# EasyEDA Pro project CameraTargetV3.eprj, board PCB1
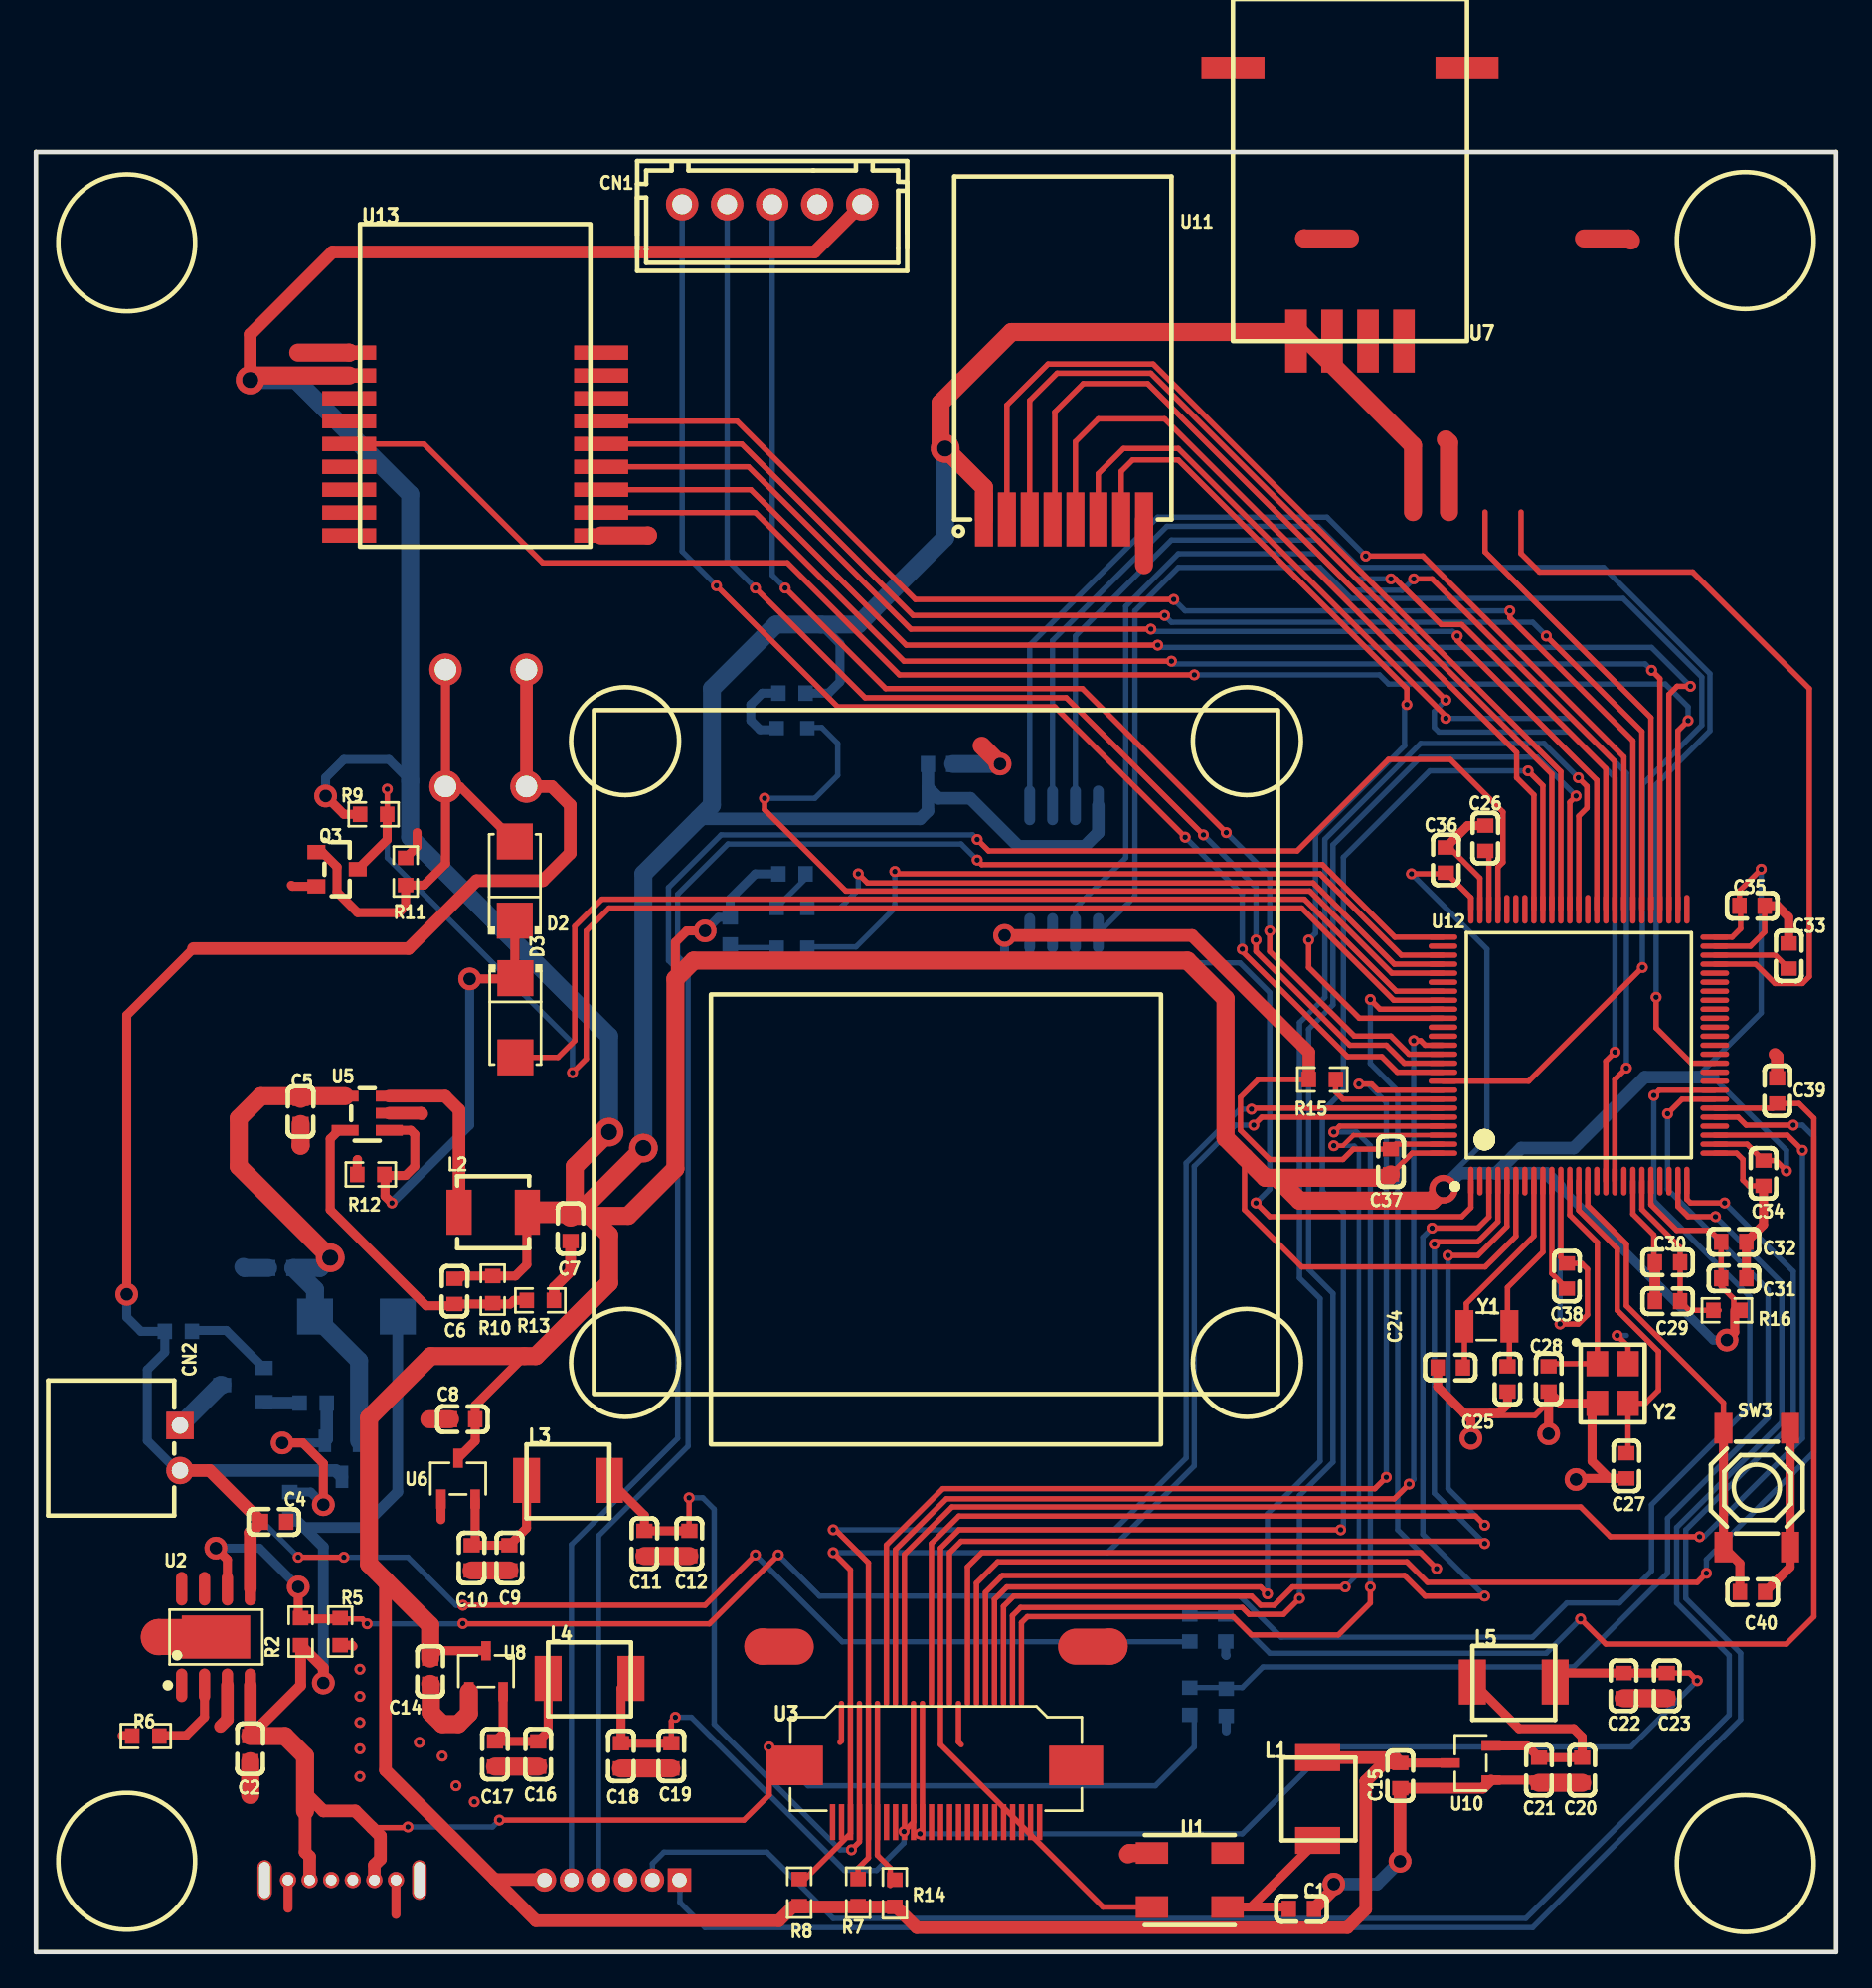
[diagram p1: board, top side]
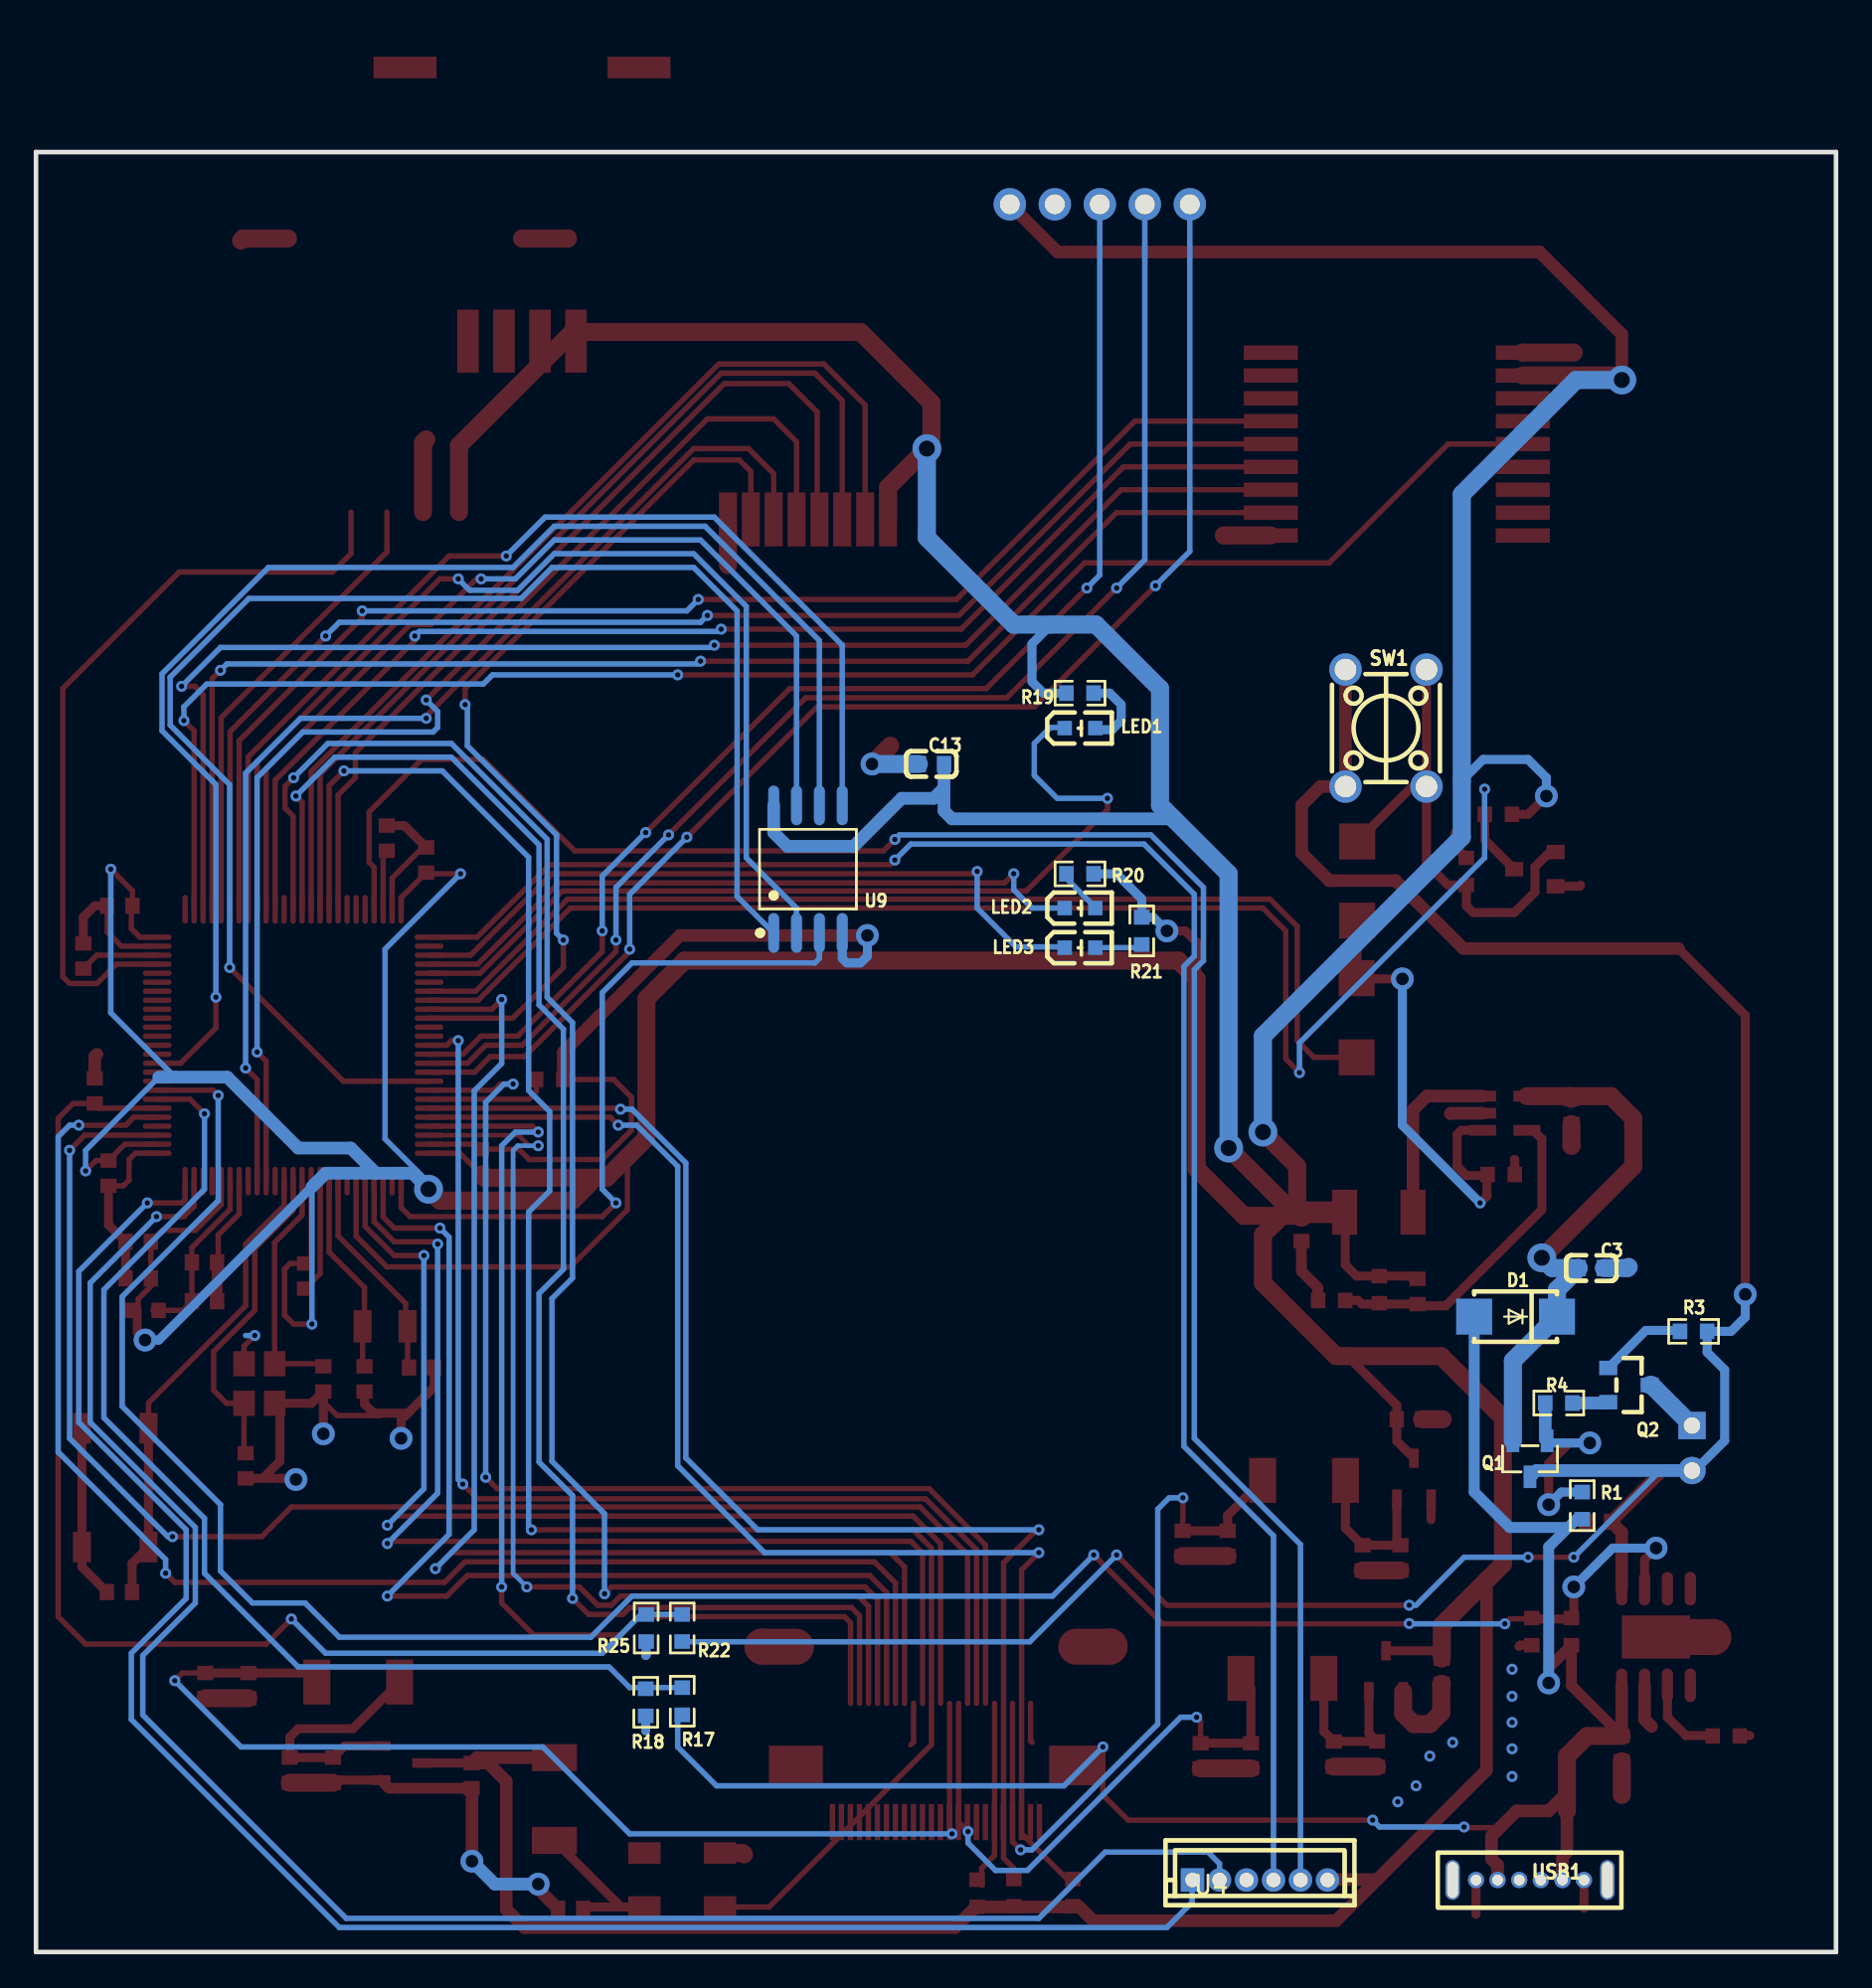
[diagram p2: board, bottom side, seen from below]

Outline 100 x 100 mm; copper layers: Top Layer, Bottom Layer. Coordinates in mm from the lower left corner of the outline.
Outline path: 0,100 0,0 arc(0,0) 0,0 100,0 arc(100,0) 100,0 100,100 arc(100,100) 100,100 0,100 arc(0,100) 0,100
Stack: Top Layer 0.035mm / Dielectric1 1.51mm FR4 er 4.5 / Bottom Layer 0.035mm

## Design rules (mm)
spacing safeClearance (default): track to track 0.152, other pairs 0.152 to 0.3
track width trackWidth (default): min 0.127, default 0.254, max 2.54
differential pair differentialPair (default): width min 0.127, default 0.254, max 2.54; gap min 0.152, default 0.152
via viaSize (default): diameter min 0.5, default 0.61, max 10; hole min 0.3, default 0.305, max 6

## Placement (name value [footprint] x y rotation side)
C1  0.1uF  [C0603]  70.3 2.4 180 top
C2  1uF  [C0603]  11.9 11.3 90 top
C3  4.7uF  [C0603]  13.6 38 0 bottom
C4  4.7uF  [C0603]  13.2 23.9 180 top
C5  10uF  [C0603]  14.7 46.7 90 top
C6  22pF  [C0603]  23.25 36.7 270 top
C7  10uF  [C0603]  29.7 40.2 90 top
C8  1uF  [C0603]  23.7 29.6 0 top
C9  0.1uF  [C0603]  26.3 21.9 90 top
C10  10uF  [C0603]  24.2 21.9 90 top
C11  10uF  [C0603]  33.8 22.7 90 top
C12  0.1uF  [C0603]  36.3 22.7 90 top
C13  0.1uF  [C0603]  50.25 66 180 bottom
C14  1uF  [C0603]  21.9 15.6 90 top
C15  1uF  [C0603]  75.8 9.8 90 top
C16  0.1uF  [C0603]  27.9 11 90 top
C17  10uF  [C0603]  25.5 11 90 top
C18  10uF  [C0603]  32.5 10.9 90 top
C19  0.1uF  [C0603]  35.3 10.9 90 top
C20  0.1uF  [C0603]  85.9 10.1 90 top
C21  10uF  [C0603]  83.5 10.1 90 top
C22  10uF  [C0603]  88.2 14.8 90 top
C23  0.1uF  [C0603]  90.6 14.8 90 top
C24  15pF  [C0603]  78.58 32.47 0 top
C25  15pF  [C0603]  81.75 31.84 90 top
C26  0.1uF  [C0603]  80.52 61.88 270 top
C27  22pF  [C0603]  88.35 27.01 90 top
C28  22pF  [C0603]  84.04 31.84 270 top
C29  1uF  [C0603]  90.64 36.16 180 top
C30  0.1uF  [C0603]  90.64 38.32 180 top
C31  1uF  [C0603]  94.32 37.43 180 top
C32  0.1uF  [C0603]  94.32 39.46 180 top
C33  0.1uF  [C0603]  97.37 55.33 270 top
C34  0.1uF  [C0603]  95.97 43.27 90 top
C35  0.1uF  [C0603]  95.34 58.13 180 top
C36  0.1uF  [C0603]  78.32 60.67 270 top
C37  0.1uF  [C0603]  75.27 43.9 270 top
C38  0.1uF  [C0603]  85.05 37.55 90 top
C39  0.1uF  [C0603]  96.74 47.84 270 top
C40  0.1uF  [C0603]  95.36 20 180 top
CN1  灯板连接口 2.54 5p直插  [CONN-TH_5P-P2.50_HX25003-5A]  40.9 97.1 0 top
CN2  HDGC2501WR-2P  [CONN-TH_2P-P2.50_HDGC2501WR-2P]  8 28 270 top
D1  -  [DO-214AC_L4.3-W2.7-LS5.3-RD]  17.8 35.3 0 bottom
D2  SS14A  [SMA_L4.3-W2.6-LS5.2-RD]  26.6 59.5 90 top
D3  SS14A  [SMA_L4.3-W2.6-LS5.2-RD]  26.63 51.91 270 top
L1  -  [0420]  69.2 6.2 90 top
L2  2.2uH  [IND-SMD_L4.0-W4.0_0.47UH04209.5A]  25.4 41.1 0 top
L3  -  [0420]  27.25 28.2 0 top
L4  -  [0420]  28.45 17.2 0 top
L5  -  [0420]  79.8 17 0 top
LED1  TLMG1100-GS08  [LED0603-R-RD_GREEN]  42 68 180 bottom
LED2  TLMG1100-GS08  [LED0603-R-RD_GREEN]  42 58 180 bottom
LED3  TLMS1000-GS08  [LED0603-R-RD]  42 55.8 180 bottom
Q1  -  [SOT-23-3_L2.9-W1.3-P1.90-LS2.4-BR]  17 27.4 90 bottom
Q2  AO3400  [SOT-23_L2.9-W1.3-P1.90-LS2.4-BR]  11.5 31.5 0 bottom
Q3  AO3400  [SOT-23_L2.9-W1.3-P1.90-LS2.4-BR]  16.73 60.16 180 top
R1  1kΩ  [R0603]  14.1 24.8 270 bottom
R2  20kΩ  [R0603]  14.7 17.8 270 top
R3  10kΩ  [R0603]  7.91 34.48 180 bottom
R4  10kΩ  [R0603]  15.4 30.5 0 bottom
R5  30kΩ  [R0603]  16.9 17.8 270 top
R6  3kΩ  [R0603]  6.1 12 0 top
R7  4.7kΩ  [R0603]  45.67 3.3 270 top
R8  4.7kΩ  [R0603]  42.4 3.3 270 top
R9  100kΩ  [R0603]  18.76 63.21 180 top
R10  453kΩ  [R0603]  25.37 36.8 90 top
R11  10kΩ  [R0603]  20.54 60.03 270 top
R12  100kΩ  [R0603]  18.6 43.2 0 top
R13  100kΩ  [R0603]  28.02 36.2 180 top
R14  10kΩ  [R0603]  47.71 3.26 270 top
R15  10kΩ  [R0603]  71.46 48.48 0 top
R16  47Ω  [R0603]  93.94 35.65 180 top
R17  20kΩ  [R0603]  64.1 13.93 270 bottom
R18  30kΩ  [R0603]  66.13 13.87 90 bottom
R19  1kΩ  [R0603]  42 69.94 0 bottom
R20  1kΩ  [R0603]  42 59.9 180 bottom
R21  1kΩ  [R0603]  38.57 56.73 90 bottom
R22  300kΩ  [R0603]  64.1 18 270 bottom
R25  100kΩ  [R0603]  66.1 18 270 bottom
SW1  -  [按钮开关]  25 68 270 bottom
SW3  1TS001G-2700-1500-CT  [SW-SMD_4P-L5.1-W5.1-P3.70-LS6.5-TL-2]  95.6 25.8 90 top
U1  -  [5032-4P]  64.1 4 180 top
U2  -  [PW4056]  10 17.5 0 top
U3  -  [OV2640]  50 17 0 top
U4  HDGC1501WV-6P  [CONN-TH_6P-P1.50_HDGC_HDGC1501WV-6P]  32 4 180 bottom
U5  -  [PW2051]  18.4 46.6 0 top
U6  -  [SOT-23-3_L2.9-W1.6-P1.90-LS2.9-BL]  23.45 26.3 0 top
U7  -  [GC2400-TC010R]  73 99 0 top
U8  -  [SOT-23-3_L2.9-W1.6-P1.90-LS2.9-BL]  25 15.6 0 top
U9  W25Q64JVSSIQ  [SOP-8_L5.3-W5.3-P1.27-LS8.0-BL]  57.11 60.16 180 bottom
U10  -  [SOT-23-3_L2.9-W1.6-P1.90-LS2.9-BL]  79.7 10.5 90 top
U11  AS01-ML01IPX  [WIRELM-SMD_8P-L19.0-W12.0-P1.27]  57.11 79.59 0 top
U12  STM32H7B0VBT6  [LQFP-100_L14.0-W14.0-P0.50-LS16.0-BL]  85.72 50.38 0 top
U13  -  [XY-MBA32A]  18 96 0 top
USB1  -  [typec]  17 4 0 bottom
Y1  -  [3215]  80.61 34.76 180 top
Y2  -  [XTAL3225]  87.59 31.59 270 top

## Footprints (pads in the part's own frame, mm; a bottom-side part is the same pattern mirrored in y, then rotated)
0420
  rect 1.5x2.5 smd: 1(0,-2) 2(4.6,-2)
3215
  rect 1x1.8 smd: 1(-1.25,0) 2(1.25,0)
5032-4P
  rect 1.8x1.2 smd: 1(-2.1,-1.5) 2(2.1,-1.5) 3(2.1,1.5) 4(-2.1,1.5)
C0603
  rect 0.8x0.9 smd: 1(-0.7,0) 2(0.7,0)
CONN-TH_2P-P2.50_HDGC2501WR-2P
  rect 1.524x1.524 hole 0.914: 1(-1.25,0)
  round 1.524 hole 0.914: 2(1.25,0)
CONN-TH_5P-P2.50_HX25003-5A
  round 1.8 hole 1.1: 1(-5,0) 2(-2.5,0) 3(0,0) 4(2.5,0) 5(5,0)
CONN-TH_6P-P1.50_HDGC_HDGC1501WV-6P
  rect 1.3x1.3 hole 0.8: 1(-3.75,0)
  round 1.3 hole 0.8: 2(-2.25,0) 3(-0.75,0) 4(0.75,0) 5(2.25,0) 6(3.75,0)
DO-214AC_L4.3-W2.7-LS5.3-RD
  rect 1.999x1.999 smd: 1(-2.299,0) 2(2.301,0)
GC2400-TC010R
  rect 1.2x3.5 smd: 2(-3,-9.5) 3(-1,-9.5) 4(1,-9.5) 5(3,-9.5)
  rect 3.5x1.2 smd: 7(6.5,5.7) 8(-6.5,5.7)
IND-SMD_L4.0-W4.0_0.47UH04209.5A
  rect 1.399x2.499 smd: 1(-1.9,0) 2(1.9,0)
LED0603-R-RD
  rect 0.8x0.8 smd: 1(0.851,0) 2(-0.851,0)
LED0603-R-RD_GREEN
  rect 0.8x0.8 smd: 1(0.851,0) 2(-0.851,0)
LQFP-100_L14.0-W14.0-P0.50-LS16.0-BL
  oval 0.3x1.6 smd: 1(-6,-7.55) 2(-5.5,-7.55) 3(-5,-7.55) 4(-4.5,-7.55) 5(-4,-7.55) 6(-3.5,-7.55) 7(-3,-7.55) 8(-2.5,-7.55) 9(-2,-7.55) 10(-1.5,-7.55) 11(-1,-7.55) 12(-0.5,-7.55) 13(0,-7.55) 14(0.5,-7.55) 15(1,-7.55) 16(1.5,-7.55) 17(2,-7.55) 18(2.5,-7.55) 19(3,-7.55) 20(3.5,-7.55) 21(4,-7.55) 22(4.5,-7.55) 23(5,-7.55) 24(5.5,-7.55) 25(6,-7.55) 51(6,7.55) 52(5.5,7.55) 53(5,7.55) 54(4.5,7.55) 55(4,7.55) 56(3.5,7.55) 57(3,7.55) 58(2.5,7.55) 59(2,7.55) 60(1.5,7.55) 61(1,7.55) 62(0.5,7.55) 63(0,7.55) 64(-0.5,7.55) 65(-1,7.55) 66(-1.5,7.55) 67(-2,7.55) 68(-2.5,7.55) 69(-3,7.55) 70(-3.5,7.55) 71(-4,7.55) 72(-4.5,7.55) 73(-5,7.55) 74(-5.5,7.55) 75(-6,7.55)
  oval 1.6x0.3 smd: 26(7.55,-6) 27(7.55,-5.5) 28(7.55,-5) 29(7.55,-4.5) 30(7.55,-4) 31(7.55,-3.5) 32(7.55,-3) 33(7.55,-2.5) 34(7.55,-2) 35(7.55,-1.5) 36(7.55,-1) 37(7.55,-0.5) 38(7.55,0) 39(7.55,0.5) 40(7.55,1) 41(7.55,1.5) 42(7.55,2) 43(7.55,2.5) 44(7.55,3) 45(7.55,3.5) 46(7.55,4) 47(7.55,4.5) 48(7.55,5) 49(7.55,5.5) 50(7.55,6) 76(-7.55,6) 77(-7.55,5.5) 78(-7.55,5) 79(-7.55,4.5) 80(-7.55,4) 81(-7.55,3.5) 82(-7.55,3) 83(-7.55,2.5) 84(-7.55,2) 85(-7.55,1.5) 86(-7.55,1) 87(-7.55,0.5) 88(-7.55,0) 89(-7.55,-0.5) 90(-7.55,-1) 91(-7.55,-1.5) 92(-7.55,-2) 93(-7.55,-2.5) 94(-7.55,-3) 95(-7.55,-3.5) 96(-7.55,-4) 97(-7.55,-4.5) 98(-7.55,-5) 99(-7.55,-5.5) 100(-7.55,-6)
OV2640
  rect 0.3x2 smd: 1(-5.747,-9.785) 2(-5.247,-9.785) 3(-4.747,-9.785) 4(-4.247,-9.785) 5(-3.747,-9.785) 6(-3.247,-9.785) 7(-2.747,-9.785) 8(-2.247,-9.785) 9(-1.747,-9.785) 10(-1.247,-9.785) 11(-0.747,-9.785) 12(-0.247,-9.785) 13(0.253,-9.785) 14(0.753,-9.785) 15(1.253,-9.785) 16(1.753,-9.785) 17(2.253,-9.785) 18(2.753,-9.785) 19(3.253,-9.785) 20(3.753,-9.785) 21(4.253,-9.785) 22(4.753,-9.785) 23(5.253,-9.785) 24(5.753,-9.785)
  rect 3x2.2 smd: 25(7.785,-6.636) 26(-7.785,-6.636)
PW2051
  rect 1.5x0.6 smd: 1(1.227,-0.95) 2(1.227,0) 3(1.227,0.95) 4(-1.227,0.95) 5(-1.227,-0.95)
PW4056
  oval 0.63x1.865 smd: 1(-1.905,-2.683) 2(-0.635,-2.683) 3(0.635,-2.683) 4(1.905,-2.683) 5(1.905,2.683) 6(0.635,2.683) 7(-0.635,2.683) 8(-1.905,2.683)
  rect 3.8x2.4 smd: 9(0,0)
R0603
  rect 0.806x0.864 smd: 1(-0.753,0) 2(0.753,0)
SMA_L4.3-W2.6-LS5.2-RD
  rect 2x2 smd: 1(-2.2,0) 2(2.2,0)
SOP-8_L5.3-W5.3-P1.27-LS8.0-BL
  oval 0.609x2.204 smd: 1(-1.905,-3.542) 2(-0.635,-3.542) 3(0.635,-3.542) 4(1.905,-3.542) 5(1.905,3.542) 6(0.635,3.542) 7(-0.635,3.542) 8(-1.905,3.542)
SOT-23-3_L2.9-W1.3-P1.90-LS2.4-BR
  rect 1.25x0.701 smd: 1(1.001,-0.95) 2(1.001,0.95) 3(-1.001,0)
SOT-23-3_L2.9-W1.6-P1.90-LS2.9-BL
  rect 0.532x1.07 smd: 1(-0.95,-1.135) 2(0.95,-1.135) 3(0,1.135)
SOT-23_L2.9-W1.3-P1.90-LS2.4-BR
  rect 1x0.8 smd: 1(1.15,-0.95) 2(1.15,0.95) 3(-1.15,0)
SW-SMD_4P-L5.1-W5.1-P3.70-LS6.5-TL-2
  rect 1.7x1 smd: 1(-3.3,1.849) 2(3.3,1.851) 3(-3.3,-1.851) 4(3.3,-1.851)
typec
  round 0.9 hole 0.6: 1(-3,0) 2(-1.8,0) 3(-0.6,0) 4(0.6,0) 5(1.8,0) 6(3,0)
  oval 0.8x2.2 hole 0.6x2: 7(-4.3,0) 8(4.3,0)
WIRELM-SMD_8P-L19.0-W12.0-P1.27
  rect 1x3 smd: 1(-4.445,0) 2(-3.175,0) 3(-1.905,0) 4(-0.635,0) 5(0.635,0) 6(1.905,0) 7(3.175,0) 8(4.445,0)
XTAL3225
  rect 1.4x1.2 smd: 1(-1.1,-0.85) 2(1.1,-0.85) 3(1.1,0.85) 4(-1.1,0.85)
XY-MBA32A
  rect 3x0.8 smd: 1(-0.6,-7.14) 2(-0.6,-8.41) 3(-0.6,-9.68) 4(-0.6,-10.95) 5(-0.6,-12.22) 6(-0.6,-13.49) 7(-0.6,-14.76) 8(-0.6,-16.03) 9(-0.6,-17.3) 10(13.4,-17.3) 11(13.4,-16.03) 12(13.4,-14.76) 13(13.4,-13.49) 14(13.4,-12.22) 15(13.4,-10.95) 16(13.4,-9.68) 17(13.4,-8.41) 18(13.4,-7.14)
按钮开关
  round 1.8 hole 1.2: 1(-3.25,2.25) 2(3.25,2.25) 3(-3.25,-2.25) 4(3.25,-2.25)

## Nets
As in the schematic.

Pads without a net: U1 1; U2 1 7 8; U3 1 23 24; U12 2 7 15 18 22 23 29 34 35 37 38 39 40 41 42 43 44 45 46 51 62 69 70 71 77 81 86 87; U13 3 4 6 7 8 9 16 17 18; USB1 3 4 7 8

## Via types
v1: diameter 1.6, hole 0.9, Top Layer to Bottom Layer, 6 vias
v2: diameter 0.61, hole 0.305, Top Layer to Bottom Layer, 106 vias
v3: diameter 1.27, hole 0.711, Top Layer to Bottom Layer, 17 vias

## Routing (per net, layer and track width the routed paths; a pad name or vN(x,y) marks a point on that pad's centre or on a via; arc(x,y) is an arc through that point)
+3.3V: length 619.6
  Top Layer w0.3: 67.15,44.17 67.15,41.24 70.32,38.06 80.51,38.06 82.22,39.77 U12.6 ; 94.38,35.65 94.32,35.7 94.32,36.28 93.62,36.98 C31.2 C32.2 92.99,40.09 91.15,40.09 89.72,41.53 U12.21 ; 93.27,56.38 94.23,56.38 94.7,56.86 94.7,58.06 C35.2 94.64,58.95 v2(95.85,60.16) ; U12.11 84.72,38.59 C38.2 85.88,38.25 86.2,37.94 86.2,35.4 85.69,34.89 v2(84.67,34.89) ; U12.75 79.72,58.57 C36.2 78.26,59.91 v2(76.42,59.91) ; 93.27,44.88 95.06,44.88 95.97,43.97 96.67,43.97 v2(97.24,43.4) ; U12.100 76.45,44.38 C37.2
  Top Layer w0.5: U10.3 C15.2 ; U6.3 24.4,28.39 C8.2 24.4,30.37 27.14,33.11 ; C6.1 23.5,37.4 23.65,37.55 R10.2 26.63,37.55 27.27,38.19 27.27,41.07 L2.2 ; 94.38,35.65 94.38,34.43 v3(93.94,34) ; C14.2 22.34,16.74 25,16.74 ; v3(37.17,56.73) 36.16,56.73 35.52,56.1 35.52,54.06 ; v3(16.09,64.22) 17.11,63.21 R9.2
  Top Layer w0.7: U4.6 28.22,4.03 25.49,4.03 ; L1.2 75.5,10.8 C15.2 74.89,10.5 73.88,9.49 73.88,2.38 72.86,1.36 48.93,1.36 47.79,2.5 42.04,2.5 41.27,1.74 27.78,1.74 25.49,4.03 ; 25.49,4.03 19.42,10.1 19.42,20.64 ; 29.93,41.75 29.93,41.01 ; v1(11.9,87.34) 11.9,89.88 16.47,94.45 43.25,94.45 CN1.5
  Top Layer w1: 30.24,41.44 29.93,41.75 29.93,43.65 v1(31.84,45.56) ; 30.24,41.44 30.78,40.9 ; 30.24,41.44 C7.2 30.78,40.9 ; 30.24,41.44 30.52,41.44 v1(33.74,44.67) ; 68.92,43.02 75.08,43.02 C37.2 ; 68.92,43.02 68.3,43.02 66.09,45.22 66.09,52.96 63.97,55.08 36.54,55.08 35.52,54.06 35.52,43.52 32.9,40.9 30.78,40.9 ; 68.92,43.02 70.19,41.75 77.56,41.75 v1(78.19,42.38) ; 30.78,40.9 31.84,39.84 31.84,37.17 27.78,33.11 21.93,33.11 18.5,29.68 18.5,21.55 21.9,18.16 C14.2 ; v1(11.9,87.34) 12.15,87.59 U13.2 ; U11.1 52.67,81.37 50.25,83.78 50.25,86.07 54.19,90.01 70.19,90.01 76.5,83.7 76.5,80
  Top Layer w1.2: C7.2 29.5,41.1 L2.2
  Bottom Layer w0.3: 93.18,48.6 97.24,44.54 v2(97.24,43.4) ; 85.05,42.22 85,42.17 ; v1(78.19,42.38) 78.19,42.76 80.61,45.17 80.61,55.72 v2(76.42,59.91) ; 92.27,48.6 95.85,52.18 v2(95.85,60.16) ; v2(84.67,34.89) 84.67,42.51
  Bottom Layer w0.5: v3(93.94,34) 93.18,34 84.67,42.51 ; v3(16.09,64.22) 16.09,65.24 17.11,66.26 19.61,66.26 20.79,65.07 ; R20.2 39.96,59.9 38.57,58.51 R21.2 37.93,57.48 v3(37.17,56.73) ; R19.2 44.03,69.94 44.67,70.57 44.67,72.68 43.6,73.75
  Bottom Layer w0.7: 49.55,64.67 49.55,63.4 49.11,62.95 36.79,62.95 ; 49.55,64.67 50.13,64.1 51.91,64.1 54.57,61.43 58.26,61.43 59.02,62.19 U9.8 ; 49.55,64.67 C13.2 ; 93.18,48.6 89.37,48.6 85.43,44.67 82.51,44.67 81.12,43.27 ; 81.12,43.27 79.08,43.27 v1(78.19,42.38) ; 81.12,43.27 83.91,43.27 84.67,42.51
  Bottom Layer w1: v1(50.51,83.53) 50.51,78.58 45.68,73.75 41.11,73.75 37.55,70.19 37.55,63.72 33.74,59.91 v1(33.74,44.67) ; v1(31.84,45.56) 31.84,50.89 20.79,61.94 20.79,80.99 14.44,87.34 v1(11.9,87.34)
+3.7V: length 148
  Top Layer w0.3: v2(14.57,21.93) v2(17.11,21.93) ; v2(23.71,19.27) 37.17,19.27 v2(39.97,22.06)
  Top Layer w0.5: v3(5.04,36.54) 5.04,52.04 8.75,55.75
  Top Layer w0.7: SW1.3 SW1.4 28.65,64.75 29.68,63.72 29.68,61.05 28.16,59.53 24.47,59.53 20.7,55.75 8.75,55.75 ; CN2.2 9.65,26.75 C4.2 11.91,23.31 U2.5
  Bottom Layer w0.3: v2(17.11,21.93) 20.66,21.93 23.33,19.27 v2(23.71,19.27) ; v2(39.97,22.06) 44.79,17.23 64.09,17.23 R22.2 ; 9.75,26.75 v2(14.57,21.93)
  Bottom Layer w0.5: v3(5.04,36.54) 5.04,35.27 5.83,34.48 R3.2 7.16,33.32 6.19,32.35 6.19,28.41 7.85,26.75 CN2.2
  Bottom Layer w0.7: Q1.3 16.65,26.75 CN2.2
AVDD: length 40.4
  Top Layer w0.3: C12.2 36.28,23.42 v2(36.28,25.24) ; 45.75,13.81 45.75,6.12 v2(45.3,5.68)
  Top Layer w0.5: C12.2 C11.2 33.8,24.25 L3.2
  Bottom Layer w0.3: v2(36.28,25.24) 37.05,25.24 37.68,24.6 37.68,12.66 44.67,5.68 v2(45.3,5.68)
DVDD: length 33
  Top Layer w0.3: v2(48.22,6.69) 48.75,7.22 48.75,13.81 ; C19.2 35.3,12.82 v2(35.52,13.04)
  Top Layer w0.5: L4.2 32.5,14.65 C18.2 C19.2
  Bottom Layer w0.3: v2(35.52,13.04) 36.41,13.04 44.92,4.53 46.7,4.53 48.22,6.06 v2(48.22,6.69)
GND: length 218.6
  Top Layer w0.3: U12.74 80.22,59.66 78.51,61.37 C36.1 ; C34.1 95.15,42.57 94.83,42.89 94.83,44.03 94.48,44.38 93.27,44.38 ; 93.27,55.88 95.25,55.88 96.04,56.67 C35.1 ; U12.19 88.72,41 89.88,39.84 89.88,38.38 C30.2 ; 44.75,13.81 44.75,11.73 44.67,11.65 ; 84.04,30.57 83.27,29.81 80.95,29.81 80.82,29.93 ; U12.99 75.55,44.88 C37.1 73.18,44.6 72.61,44.03 68.54,44.03 66.92,45.65 66.92,47.49 67.91,48.48 R15.1 ; C38.1 84.22,37.69 U12.10 ; 51.25,13.81 51.25,11.67 51.4,11.52 ; v2(87.85,34.25) 88.44,33.66 Y2.4
  Top Layer w0.5: 87.4,26.31 86.45,27.27 86.45,30.19 Y2.2 84.69,30.49 C28.2 v3(84.04,28.79) ; 87.4,26.31 85.62,26.31 v3(85.56,26.25) ; 87.4,26.31 C27.1 ; Q3.2 14.25,59.21 14.19,59.27 ; 20,2.09 USB1.6 ; R5.2 17.55,17.05 17.62,16.98 ; 14,2.43 USB1.1 ; C31.1 C32.1 95.97,40.41 C34.1 ; R12.1 17.85,44.01 17.87,44.03 ; C33.1 97.37,57.49 96.74,58.13 C35.1 ; C36.1 79.53,62.58 C26.1 ; C25.1 81.75,30.44 81.24,29.93 79.34,29.93 ; 4.79,12.03 5.32,12.03 R6.1 ; 80.84,9.55 83.35,9.55 C21.1 ; v3(79.72,28.54) 79.72,29.55 79.34,29.93 ; C24.1 77.87,31.4 79.34,29.93 ; 22.5,25.17 22.5,24.02 ; C40.1 97.45,21.39 SW3.3 SW3.4 ; R11.1 21.17,61.42 21.17,62.19
  Top Layer w0.6: C15.1 80.39,9.1 80.84,9.55 ; R13.1 28.79,36.22 28.79,36.92 29.7,37.83 C7.1 ; C30.2 C29.2
  Top Layer w0.7: 10.25,12.54 10.64,12.92 U2.3 ; v3(75.78,5.04) 75.78,9.08 C15.1 ; C39.1 96.74,49.75 96.61,49.87 ; v3(53.81,56.48) 64.22,56.48 70.71,49.99 R15.1 ; 21.43,46.57 21.4,46.6 U5.2 ; C1.1 72.1,3.5 v3(72.1,3.77)
  Top Layer w1: 78.32,84.04 78.5,83.86 78.5,80 ; C22.1 C23.1 ; C16.1 C17.1 ; C10.1 C9.1 ; U13.10 34,78.7 34,78.7 ; 14.69,44.79 14.7,44.8 C5.1 ; C21.1 C20.1 ; U1.2 60.75,5.5 60.67,5.42 ; 73,95.2 70.46,95.2 70.45,95.21 ; C11.1 C12.1 ; C8.1 21.85,29.6 ; C19.1 C18.1 ; U13.1 17.4,88.86 14.57,88.86 ; 52.54,67.02 v3(53.56,66) ; U8.1 24.05,13.26 23.46,12.66 22.57,12.66 21.93,13.3 21.93,14.87 C14.1 ; C2.1 11.9,8.73 ; 88.61,95.09 88.49,95.2 86,95.2 ; U11.8 61.56,77.05
  Top Layer w2: 40.35,16.98 40.37,16.96 42.21,16.96 ; U2.9 6.83,17.5 6.82,17.49 ; 57.78,16.96 59.63,16.96 59.65,16.98
  Bottom Layer w0.3: v2(87.85,34.25) 88.35,34.25
  Bottom Layer w0.5: U9.4 55.21,55.21 54.95,54.95 54.19,54.95 53.81,55.33 v3(53.81,56.48) ; R18.1 66.13,13.12 66.13,12.28 ; R25.2 66.1,16.5 66.13,16.47
  Bottom Layer w0.7: v3(72.1,3.77) 74.51,3.77 v3(75.78,5.04) ; Q2.2 12.7,30.5 R4.1
  Bottom Layer w1: C3.1 11.58,38 11.52,38.06 ; v3(53.56,66) C13.1
  vias: v2(18,15.71) v2(18,14.2) v2(18,12.76) v2(18,11.29) v2(18,9.75) v2(21.3,11.65) v2(22.57,10.88) v2(23.33,9.23) v2(24.35,8.34)
VIN: length 29.9
  Top Layer w1: 14.85,47.55 12.5,47.55 11.27,46.32 11.27,43.65 v1(16.35,38.57) ; 14.85,47.55 C5.2 ; 14.85,47.55 U5.4
  Bottom Layer w1: Q1.2 17.95,32.85 D1.1 15.5,36.8 C3.2 15.78,38 v1(16.35,38.57)
ADC_BAT: length 71.2
  Top Layer w0.3: 93.27,46.88 96.48,46.88 C39.2 97.95,47.14 98.77,46.32 98.77,18.63 97.24,17.11 87.21,17.11 v2(85.81,18.5)
  Bottom Layer w0.3: R22.1 64.1,18.76 66.38,18.76 68.54,16.6 83.91,16.6 v2(85.81,18.5)
AS01_CE: length 55.1
  Top Layer w0.3: U12.65 84.72,65.58 62.07,88.23 56.22,88.23 53.94,85.94 U11.2
AS01_CSN: length 53
  Top Layer w0.3: U11.3 55.21,86.2 56.73,87.72 61.93,87.72 84.22,65.44 U12.66
AS01_IRQ: length 50.4
  Top Layer w0.3: v2(70.7,56.22) 70.7,54.7 73.52,51.88 U12.85 ; U11.7 60.29,82.26 60.92,82.89 63.46,82.89 76.16,70.19 v2(76.16,69.3)
  Bottom Layer w0.3: v2(76.16,69.3) 76.04,69.18 76.04,67.02 71.08,62.07 71.08,56.6 v2(70.7,56.22)
BAT_CHRG: length 62.3
  Top Layer w0.3: 93.27,47.38 91.45,47.38 v2(90.64,46.57)
  Bottom Layer w0.3: v2(90.64,46.57) 90.64,42.38 96.23,36.79 96.23,29.68 90.64,24.09 90.64,21.04 85.43,15.84 68.16,15.84 67.02,14.69 64.11,14.69 R17.1
BAT_DONE: length 124.5
  Top Layer w0.3: v2(18.4,18.23) 18.13,18.5 16.95,18.5 R5.1 ; v2(41.24,22.06) 37.41,18.23 23.73,18.23 v2(23.71,18.25) ; v2(89.88,47.59) 90.17,47.88 93.27,47.88
  Top Layer w0.5: 16.9,18.5 14.57,18.5 v3(14.57,20.28) ; U2.6 10.64,21.8 v3(10,22.44)
  Bottom Layer w0.3: v2(89.88,47.59) 89.88,41.75 95.21,36.41 95.21,30.32 89.75,24.85 89.75,21.17 87.97,19.39 85.05,19.39 83.15,17.49 69.18,17.49 66.89,19.77 43.52,19.77 v2(41.24,22.06) ; v2(18.4,18.23) 23.69,18.23 v2(23.71,18.25)
  Bottom Layer w0.5: v3(14.57,20.28) 12.41,22.44 v3(10,22.44)
BLE_BRTS: length 74.3
  Top Layer w0.3: v2(81.88,74.51) 81.88,74.13 88.72,67.29 U12.57 ; v2(63.21,75.15) 48.86,75.15 38.95,85.05 31.4,85.05 U13.15
  Bottom Layer w0.3: v2(63.21,75.15) 63.84,74.51 v2(81.88,74.51)
BLE_CDS: length 69.8
  Top Layer w0.3: U13.13 31.4,82.51 39.59,82.51 48.6,73.5 v2(61.94,73.5) ; U12.61 86.72,65.1 78.96,72.86 v2(78.96,73.11)
  Bottom Layer w0.3: v2(61.94,73.5) 62.07,73.37 78.7,73.37 v2(78.96,73.11)
BLE_LINK: length 74.3
  Top Layer w0.3: U12.56 89.22,67.81 v2(83.91,73.11) ; v2(62.7,74.26) 48.73,74.26 39.21,83.78 U13.14
  Bottom Layer w0.3: v2(62.7,74.26) 63.08,73.88 83.15,73.88 v2(83.91,73.11)
BLE_RST: length 91.9
  Top Layer w0.3: v2(64.35,70.96) 47.97,70.96 41.75,77.18 28.16,77.18 21.55,83.78 U13.5 ; v2(91.78,68.42) 91.22,67.85 U12.52
  Bottom Layer w0.3: v2(91.78,68.42) 91.78,69.18 90.51,70.45 75.15,70.45 74.64,70.96 v2(64.35,70.96)
BOOT0: length 6.8
  Top Layer w0.3: R15.2 72.2,48.46 72.2,47.79 72.61,47.38 U12.94
DCMI_D0: length 90.4
  Top Layer w0.3: v2(68.42,19.9) 68.03,20.28 53.94,20.28 53.25,19.59 53.25,13.81 ; U12.63 85.72,63.11 86.17,63.56 86.17,64.76 v2(85.69,65.24)
  Bottom Layer w0.3: v2(85.69,65.24) 83.78,67.15 76.92,67.15 71.6,61.82 71.6,53.04 70.19,51.63 70.19,37.44 71.34,36.3 71.34,27.27 68.42,24.35 v2(68.42,19.9)
DCMI_D1: length 88.1
  Top Layer w0.3: v2(70.19,19.65) 69.3,18.76 67.4,18.76 67.02,19.14 54.7,19.14 54.25,18.69 54.25,13.81 ; v2(85.56,64.22) 85.22,63.88 U12.64
  Bottom Layer w0.3: v2(85.56,64.22) 83.4,66.38 76.92,66.38 72.05,61.51 72.05,52.62 70.7,51.27 70.7,37.94 72.05,36.58 72.05,27.22 70.19,25.36 v2(70.19,19.65)
DCMI_D2: length 59.1
  Top Layer w0.3: U12.97 72.42,45.88 v2(72.1,45.56) ; v2(74.13,20.28) 74.13,19.39 72.35,17.62 67.53,17.62 66.51,18.63 55.08,18.63 54.75,18.3 54.75,13.81
  Bottom Layer w0.3: v2(74.13,20.28) 74.13,44.79 73.37,45.56 v2(72.1,45.56)
DCMI_D3: length 57.6
  Top Layer w0.254: U12.98 73.19,45.38 72.61,44.79 v2(72.1,44.79)
  Top Layer w0.3: v2(72.73,20.28) 69.81,20.28 68.8,19.27 68.03,19.27 67.53,19.77 54.32,19.77 53.75,19.2 53.75,13.81
  Bottom Layer w0.254: v2(72.73,20.28) 73.5,21.04 73.5,44.54 73.24,44.79 v2(72.1,44.79)
DCMI_D4: length 62.2
  Top Layer w0.3: v2(77.56,40.22) 80.1,40.22 80.72,40.84 U12.3 ; v2(80.48,19.77) 77.18,19.77 76.04,20.92 53.68,20.92 52.75,19.98 52.75,13.81
  Bottom Layer w0.3: v2(80.48,19.77) 77.05,23.2 77.05,39.71 v2(77.56,40.22)
DCMI_D5: length 71.8
  Top Layer w0.3: U12.84 74.67,52.38 v2(74.13,52.92) ; v2(77.81,21.3) 76.92,22.19 52.54,22.19 51.75,21.39 51.75,13.81
  Bottom Layer w0.3: v2(77.81,21.3) 75.65,23.46 75.65,47.84 74.13,49.37 v2(74.13,52.92)
DCMI_D6: length 62.5
  Top Layer w0.3: v2(80.48,22.7) 80.35,22.82 51.4,22.82 50.75,22.17 50.75,13.81 ; U12.4 81.22,40.58 80.1,39.46 77.81,39.46 v2(77.69,39.33)
  Bottom Layer w0.3: v2(77.69,39.33) 77.69,25.49 v2(80.48,22.7)
DCMI_D7: length 62.7
  Top Layer w0.3: U12.5 81.72,40.31 80.1,38.7 v2(78.45,38.7) ; 49.75,13.81 49.75,22.7 51.27,24.22 79.97,24.22 v2(80.48,23.71)
  Bottom Layer w0.3: v2(78.45,38.7) 78.45,25.74 v2(80.48,23.71)
DCMI_HSYNC: length 83.4
  Top Layer w0.3: 93.27,45.38 97.29,45.38 v2(98.13,44.54) ; 48.25,13.81 48.25,22.09 50.89,24.73 85.81,24.73 87.47,23.08 v2(92.42,23.08)
  Bottom Layer w0.3: v2(98.13,44.54) 98.13,28.54 92.67,23.08 v2(92.42,23.08)
DCMI_PXCLK: length 81.1
  Top Layer w0.3: 93.27,46.38 94.57,46.38 95.01,45.94 v2(97.63,45.94) ; v2(92.8,21.04) 92.29,20.54 77.31,20.54 76.16,21.68 53.43,21.68 52.25,20.5 52.25,13.81
  Bottom Layer w0.3: v2(92.8,21.04) 92.8,21.81 98.77,27.78 98.77,45.3 98.13,45.94 v2(97.63,45.94)
DCMI_VSYNC: length 65.7
  Top Layer w0.3: v2(73.5,48.22) 74.2,48.22 74.54,47.88 U12.93 ; 47.25,13.81 47.25,22.61 50.38,25.74 74.38,25.74 v2(75.02,26.38)
  Bottom Layer w0.3: v2(75.02,26.38) 75.02,47.21 74,48.22 v2(73.5,48.22)
DOVDD: length 62.3
  Top Layer w0.3: 49.25,13.81 49.25,6.7 v2(49.11,6.57) ; C23.2 91.87,15.5 v2(92.29,15.08)
  Top Layer w0.5: L5.2 84.9,15.5 C22.2 C23.2
  Bottom Layer w0.3: v2(92.29,15.08) 88.61,11.39 71.84,11.39 67.02,6.57 v2(49.11,6.57)
KEY_ON: length 83.6
  Top Layer w0.3: v2(19.52,64.61) 19.52,63.22 R9.1 ; U12.83 75.44,52.88 70.32,58 31.84,58 30.57,56.73 30.57,49.62 v2(29.81,48.86)
  Top Layer w0.5: R9.1 19.51,61.8 Q3.3
  Bottom Layer w0.3: v2(29.81,48.86) 29.81,50.51 19.52,60.8 v2(19.52,64.61)
L_IN: length 71.3
  Top Layer w0.3: v2(41.62,75.78) 47.21,70.19 58.13,70.19 v2(66.13,62.19) ; U12.89 76.28,49.88 75.27,50.89 73.24,50.89 68.54,55.59 v2(68.54,56.73)
  Bottom Layer w0.3: CN1.3 40.9,76.5 v2(41.62,75.78) ; v2(68.54,56.73) 68.54,59.78 v2(66.13,62.19)
L_RCK: length 73.2
  Top Layer w0.3: v2(67.78,56.22) 67.78,55.59 72.99,50.38 75.02,50.38 76.02,49.38 U12.90 ; v2(64.86,62.07) 57.24,69.69 46.06,69.69 v2(39.97,75.78)
  Bottom Layer w0.3: v2(64.86,62.07) 67.78,59.14 v2(67.78,56.22) ; v2(39.97,75.78) 38.4,77.35 CN1.2
L_SCK: length 75.4
  Top Layer w0.3: v2(37.81,75.91) 44.54,69.18 56.6,69.18 v2(63.84,61.94) ; U12.91 75.63,48.88 74.77,49.75 72.86,49.75 67.02,55.59 v2(67.02,55.72)
  Bottom Layer w0.3: v2(67.02,55.72) 67.02,58.76 v2(63.84,61.94) ; CN1.1 35.9,77.82 v2(37.81,75.91)
LED_1: length 38.7
  Top Layer w0.3: U12.79 75.47,54.88 70.95,59.4 46.19,59.4 v2(45.68,59.91)
  Bottom Layer w0.3: LED2.2 44.67,58 45.68,59.02 v2(45.68,59.91)
LED_2: length 40.2
  Top Layer w0.3: U12.78 75.86,55.38 71.33,59.91 47.84,59.91 v2(47.71,60.03)
  Bottom Layer w0.3: LED3.2 42.89,55.84 45.56,55.84 47.71,58 v2(47.71,60.03)
LED_PWR: length 50.5
  Top Layer w0.3: v2(40.48,64.1) 40.48,63.46 44.99,58.95 70.76,58.95 75.33,54.38 U12.80
  Bottom Layer w0.3: LED1.2 42.89,68.03 43.65,68.03 44.54,67.15 44.54,65.37 43.27,64.1 v2(40.48,64.1)
MCU_RX1: length 75.5
  Top Layer w0.3: U13.11 39.97,79.97 48.22,71.72 v2(63.08,71.72) ; v2(89.75,71.21) 90.22,70.75 U12.54
  Bottom Layer w0.3: v2(63.08,71.72) 63.24,71.56 89.4,71.56 v2(89.75,71.21)
MCU_RX2: length 102.8
  Top Layer w0.3: U12.25 91.72,41.81 91.91,41.62 v2(93.82,41.62)
  Bottom Layer w0.3: v2(93.82,41.62) 97.63,37.81 97.63,29.43 91.66,23.46 91.66,19.65 94.7,16.6 94.7,12.92 83.15,1.36 37.17,1.36 35.78,2.76 35.78,3.97 U4.1
MCU_RX3: length 43.3
  Top Layer w0.3: 93.27,54.88 95.54,54.88 96.61,53.81 98.13,53.81 98.51,54.19 98.51,70.19 92.04,76.67 83.53,76.67 82.5,77.7 82.5,80
MCU_TX1: length 78.4
  Top Layer w0.3: v2(62.32,72.61) 48.35,72.61 39.72,81.24 U13.12 ; U12.53 90.72,69.86 91.17,70.32 v2(91.91,70.32)
  Bottom Layer w0.3: v2(91.91,70.32) 89.75,72.48 62.45,72.48 v2(62.32,72.61)
MCU_TX2: length 103.8
  Top Layer w0.3: U12.24 91.22,41.42 91.78,40.86 v2(93.31,40.86)
  Bottom Layer w0.3: U4.2 34.25,4.91 34.89,5.55 40.6,5.55 44.29,1.87 82.77,1.87 94.07,13.17 94.07,16.47 91.15,19.39 91.15,23.59 96.99,29.43 96.99,37.17 v2(93.31,40.86)
MCU_TX3: length 25.9
  Top Layer w0.3: U12.55 89.72,68.58 80.5,77.79 80.5,80
NRST: length 26.3
  Top Layer w0.3: U12.14 86.22,41.47 88.35,39.33 88.35,35.9 93.75,30.51 SW3.2
  Top Layer w0.5: 93.75,29.1 SW3.1 94.66,21.59 C40.2
OSC32_IN: length 12
  Top Layer w0.3: U12.8 83.22,39.78 79.46,36.03 79.46,34.87 Y1.2 79.36,32.56 C24.2
OSC32_OUT: length 11.2
  Top Layer w0.3: C25.2 81.86,32.65 Y1.1 81.75,34.87 81.75,36.92 83.72,38.88 U12.9
OSC_IN: length 13.5
  Top Layer w0.3: U12.12 85.22,40.95 86.74,39.42 Y2.1 84.18,32.69 C28.1
OSC_OUT: length 18.3
  Top Layer w0.3: U12.13 85.72,41.21 87.85,39.08 87.85,35.65 90.13,33.36 90.13,31.2 89.41,30.49 Y2.3 88.44,27.8 C27.2
OV_PWDN: length 65.1
  Top Layer w0.3: 47.75,13.81 47.75,22.35 50.58,25.18 75.47,25.18 v2(76.29,26) ; v2(76.54,50.64) 76.92,50.64 77.18,50.38 U12.88
  Bottom Layer w0.3: v2(76.54,50.64) 76.54,26.25 v2(76.29,26)
OV_RESET: length 10.4
  Top Layer w0.3: 46.75,13.81 46.75,5.37 47.46,4.66 47.46,3.7
OV_SCL: length 73.7
  Top Layer w0.3: U12.95 67.58,46.88 v2(67.53,46.83) ; R7.1 45.67,4.65 46.25,5.23 46.25,21.62 44.41,23.46 v2(44.29,23.46)
  Bottom Layer w0.3: v2(44.29,23.46) 59.91,23.46 63.9,27.45 63.9,43.84 66.89,46.83 v2(67.53,46.83)
OV_SDA: length 73.5
  Top Layer w0.3: U12.96 68.1,46.38 v2(67.65,45.94) ; v2(44.29,22.19) 45.25,21.23 45.25,6.58 42.72,4.05 R8.1
  Bottom Layer w0.3: v2(67.65,45.94) 66.64,45.94 64.35,43.65 64.35,27.01 59.53,22.19 v2(44.29,22.19)
OV_XCLK: length 107.7
  Top Layer w0.3: U12.67 83.72,64.8 v2(82.89,65.62) ; U1.3 59.27,2.5 50.25,11.53 50.25,22.43 51.27,23.46 v2(72.48,23.46)
  Bottom Layer w0.3: v2(82.89,65.62) 77.43,65.62 72.63,60.82 72.63,47.87 71.46,46.7 71.46,42.28 72.63,41.11 72.63,23.61 v2(72.48,23.46)
PWR_EN: length 61
  Top Layer w0.3: U12.82 75.58,53.38 70.46,58.49 31.44,58.49 29.93,56.99 29.93,50.64 29,49.71 D3.2
QSPI1_CLK: length 76.7
  Top Layer w0.3: 93.27,49.38 91.96,49.38 90.01,51.34 v2(90.01,53.05)
  Bottom Layer w0.3: U9.6 56.48,72.86 62.83,79.21 71.21,79.21 73.5,76.92 87.09,76.92 93,71.02 93,67.85 90.01,64.86 v2(90.01,53.05)
QSPI1_CS: length 84.9
  Top Layer w0.3: v2(89.24,54.7) 82.93,48.38 U12.92
  Bottom Layer w0.3: U9.1 61.05,58.65 61.05,74.51 63.46,76.92 71.33,76.92 73.05,75.2 88.17,75.2 92.55,70.83 92.55,68.16 89.24,64.86 v2(89.24,54.7)
QSPI1_IO0: length 58.8
  Top Layer w0.3: U12.58 88.22,66.4 77.05,77.56 v2(73.88,77.56)
  Bottom Layer w0.3: U9.5 55.21,72.61 62.32,79.72 71.72,79.72 v2(73.88,77.56)
QSPI1_IO1: length 61.2
  Top Layer w0.3: v2(76.54,76.29) 77.56,76.29 87.72,66.13 U12.59
  Bottom Layer w0.3: v2(76.54,76.29) 75.91,75.65 73.24,75.65 71.21,77.69 63.46,77.69 60.54,74.77 60.54,60.8 57.75,58 U9.2
QSPI1_IO2: length 40.2
  Top Layer w0.3: v2(67.78,41.62) 68.54,40.86 79.21,40.86 79.72,41.36 U12.1
  Bottom Layer w0.3: U9.3 56.48,55.21 56.73,54.95 66.89,54.95 68.54,53.3 68.54,42.38 v2(67.78,41.62)
QSPI1_IO3: length 54.2
  Top Layer w0.3: U12.60 87.22,65.74 79.21,73.75 78.07,73.75 75.53,76.29 v2(75.27,76.29)
  Bottom Layer w0.3: U9.7 57.75,73.11 63.08,78.45 71.21,78.45 73.37,76.29 v2(75.27,76.29)
SPI2_MISO: length 62.9
  Top Layer w0.3: v2(78.32,68.54) 78.32,68.67 63.46,83.53 60.41,83.53 59.02,82.13 U11.6 ; U12.17 87.72,48.47 v2(88.35,49.11)
  Bottom Layer w0.3: v2(78.32,68.54) 85.31,68.54 88.35,65.49 v2(88.35,49.11)
SPI2_MOSI: length 67.5
  Top Layer w0.3: U12.16 87.22,49.5 v2(87.72,50) ; v2(78.32,69.56) 62.7,85.18 59.02,85.18 57.75,83.91 U11.5
  Bottom Layer w0.3: v2(87.72,50) 87.72,65.24 85.18,67.78 77.94,67.78 77.69,68.03 77.69,68.92 v2(78.32,69.56)
SPI2_SCK: length 49.9
  Top Layer w0.3: U12.68 83.22,64.28 82.26,65.24 82.26,66.64 61.76,87.14 58.18,87.14 56.6,85.56 56.6,79.72 U11.4
SW_EN: length 26.8
  Top Layer w0.5: v2(19.77,41.62) 19.39,42 19.39,43.14 20.54,43.14 21.04,43.65 21.04,45.43 20.82,45.65 U5.1 ; v3(24.09,54.06) 26.59,54.06 D3.1 26.6,54.14 D2.1
  Bottom Layer w0.5: v2(19.77,41.62) 24.09,45.94 v3(24.09,54.06)
SWCLK: length 102.9
  Top Layer w0.3: v2(52.29,60.67) 52.54,60.41 71.46,60.41 75.5,56.38 U12.76
  Bottom Layer w0.3: v2(52.29,60.67) 51.4,61.56 38.44,61.56 35.65,58.76 35.65,55.33 36.23,54.75 36.23,28.1 31.25,23.12 U4.4
SWDIO: length 114.6
  Top Layer w0.3: U12.72 81.22,60.26 81.5,60.54 81.5,63.34 78.58,66.26 75.15,66.26 70.07,61.18 52.92,61.18 v2(52.29,61.81)
  Bottom Layer w0.3: U4.5 29.75,22.64 35.65,28.54 35.65,54.57 35.14,55.08 35.14,59.14 38.06,62.07 52.03,62.07 v2(52.29,61.81)
USB+: length 108.3
  Top Layer w0.3: v2(25.74,7.33) 39.33,7.33 40.73,8.73 v2(40.73,11.39) ; v2(20.66,6.95) 20.63,6.91 18.67,6.91
  Top Layer w0.6: 11.91,12.01 14.7,14.8 R2.2 15.96,15.78 v3(15.96,14.95)
  Top Layer w0.7: USB1.2 15.2,5.3 14.95,5.55 14.95,7.83 14.95,7.84 ; U2.4 11.91,12.01 C2.2 ; 15.08,8.73 15.96,7.84 17.74,7.84 19.14,6.44 19.14,5.17 18.8,4.83 USB1.5
  Top Layer w1: 14.95,7.84 14.95,10.88 13.83,12 C2.2
  Bottom Layer w0.3: v2(40.73,11.39) 42.89,9.23 62.19,9.23 64.35,11.39 64.35,12.92 R17.2 ; v2(25.74,7.33) 25.36,6.95 v2(20.66,6.95)
  Bottom Layer w0.6: 14.88,23.58 14.42,24.05 R1.2 ; 14.88,23.58 15.96,22.5 v3(15.96,14.95) ; 14.88,23.58 18.12,23.58 20.1,25.56 D1.2
$1N3281: length 8.7
  Top Layer w0.5: 67.5,2.5 69.5,2.5 C1.2 ; 67.5,2.5 L1.1 ; 67.5,2.5 U1.4
$1N3289: length 8.7
  Top Layer w0.5: 24.4,25.17 24.4,22.8 C10.2 C9.2 27.25,23.55 L3.1
$1N3295: length 9.1
  Top Layer w0.5: L4.1 28.45,12.25 C16.2 C17.2 25.95,12.15 U8.2
$1N3300: length 13.8
  Top Layer w0.5: 80.84,11.45 82.85,11.45 C21.2 C20.2 85.9,11.94 85.43,12.41 82.39,12.41 L5.1
$1N7419: length 4.4
  Top Layer w0.3: 93.27,55.38 96.62,55.38 C33.2
$1N8735: length 3.3
  Top Layer w0.3: C26.2 80.72,60.98 U12.73
$1N15961: length 9.9
  Top Layer w0.3: 93.51,35.65 91.85,35.65 C29.1 C30.1 91.34,39.14 89.22,41.27 U12.20
$1N19313: length 4.7
  Top Layer w0.5: U2.2 9.37,13.05 8.34,12.03 6.88,12.03 R6.2
$1N20232: length 11.8
  Top Layer w0.5: v3(13.68,28.28) 14.82,28.28 15.96,27.14 v3(15.96,24.85)
  Bottom Layer w0.5: R1.1 15.26,25.55 v3(15.96,24.85) ; Q1.1 15.93,28.28 v3(13.68,28.28)
  Bottom Layer w0.7: Q1.1 16.15,28.5 R4.2
$1N20234: length 4.7
  Bottom Layer w0.5: Q2.1 10.57,34.53 8.8,34.53
$1N20239: length 3.3
  Bottom Layer w1: CN2.1 10.25,31.5 Q2.3
$1N31759: length 9.9
  Top Layer w0.7: U5.3 22.73,47.55 23.5,46.78 L2.1
$1N31762: length 18.2
  Top Layer w0.5: R13.2 26.55,36.2 26.35,36 23.5,36 23.4,35.9 21.68,35.9 16.35,41.24 16.35,45.17 16.82,45.65 U5.5
$1N33058: length 27.1
  Top Layer w0.5: Q3.1 15.9,61.11 16.73,60.29 16.73,58.89 17.87,57.75 20.16,57.75 20.54,58.13 R11.2 21.56,59.28 22.75,60.47 SW1.2 ; SW1.1 SW1.2 ; SW1.2 23.55,64.75 D2.2
$1N33798: length 4.4
  Bottom Layer w0.5: R19.1 40.35,69.94 39.71,69.3 39.71,68.42 40.22,67.91 41.06,67.91 LED1.1
$1N33800: length 2.6
  Bottom Layer w0.3: R20.1 42.75,59.64 41.15,58.04 LED2.1
$1N33801: length 2.7
  Bottom Layer w0.3: R21.1 38.75,55.8 LED3.1

## Copper pours and planes (outline as drawn; the poured copper is in the pictures)
GND on Top Layer: -1.82,101.69 101.18,101.69 101.18,-1.18 -1.82,-1.18
GND on Bottom Layer: -1.82,101.69 101.18,101.69 101.18,-1.18 -1.82,-1.18
